# EAGLE design DTLJ_hexIO (EAGLE 7.2.0)
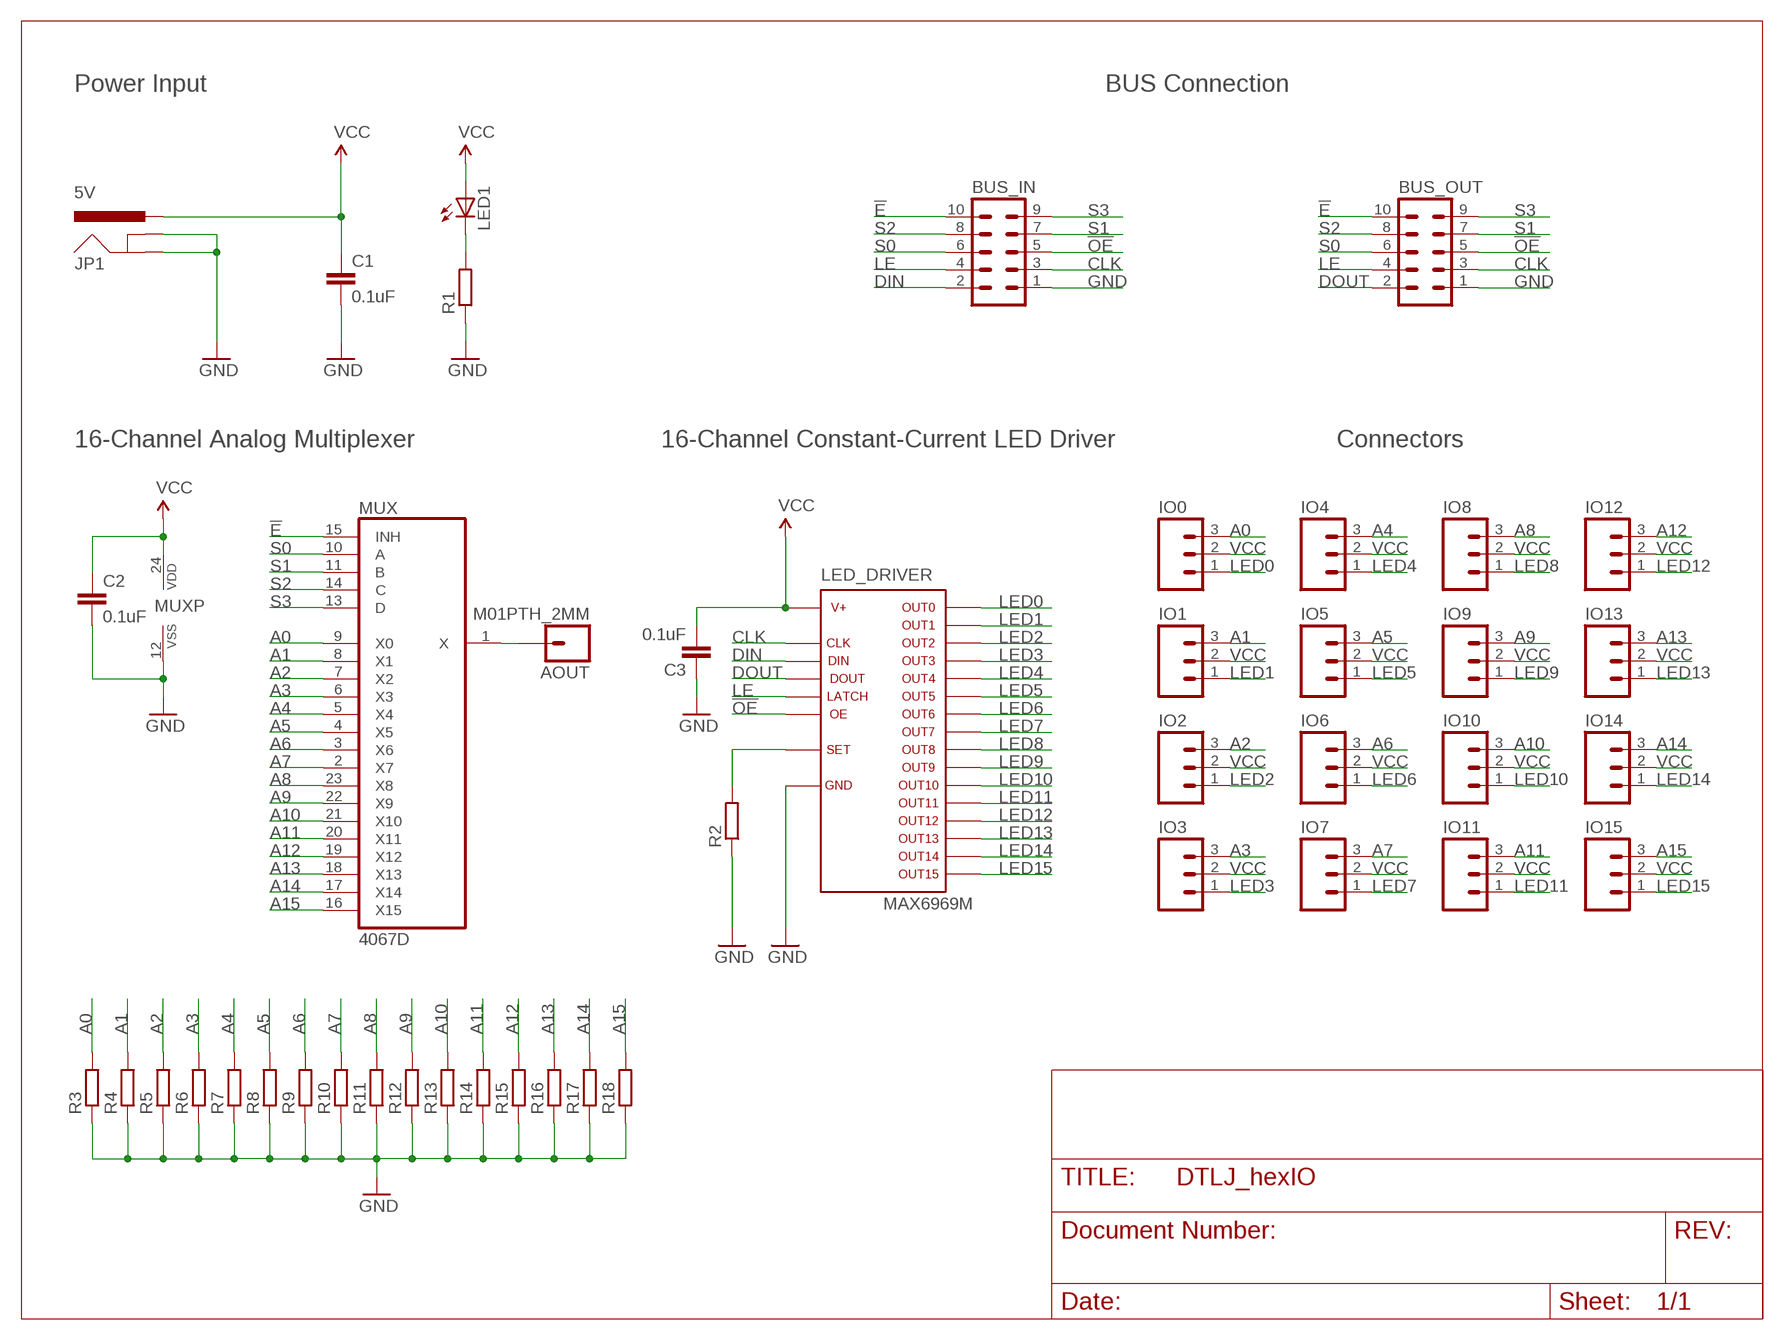
[diagram p0: schematic, sheet 1]

## Parts
AOUT  M01PTH_2MM  [1X01_2MM]
BUS_IN  ML10  [ML10]
BUS_OUT  ML10  [ML10]
C1  0.1uF  C-EU025-024X044  [C025-024X044]
C2  0.1uF  C-EU025-024X044  [C025-024X044]
C3  0.1uF  C-EU025-024X044  [C025-024X044]
IO0  M03POLAR  [MOLEX-1X3]
IO1  M03POLAR  [MOLEX-1X3]
IO2  M03POLAR  [MOLEX-1X3]
IO3  M03POLAR  [MOLEX-1X3]
IO4  M03POLAR  [MOLEX-1X3]
IO5  M03POLAR  [MOLEX-1X3]
IO6  M03POLAR  [MOLEX-1X3]
IO7  M03POLAR  [MOLEX-1X3]
IO8  M03POLAR  [MOLEX-1X3]
IO9  M03POLAR  [MOLEX-1X3]
IO10  M03POLAR  [MOLEX-1X3]
IO11  M03POLAR  [MOLEX-1X3]
IO12  M03POLAR  [MOLEX-1X3]
IO13  M03POLAR  [MOLEX-1X3]
IO14  M03POLAR  [MOLEX-1X3]
IO15  M03POLAR  [MOLEX-1X3]
JP1  5V  POWER_JACKPTH_BREAD  [POWER_JACK_PTH_BREAD]
LED1  LED3MM  [LED3MM]
LED_DRIVER  MAX6969M  [SO24W]
MUX  4067D  [SO24W]
R1  R-EU_0204/7  [0204/7]
R2  R-EU_0204/7  [0204/7]
R3  R-EU_0204/7  [0204/7]
R4  R-EU_0204/7  [0204/7]
R5  R-EU_0204/7  [0204/7]
R6  R-EU_0204/7  [0204/7]
R7  R-EU_0204/7  [0204/7]
R8  R-EU_0204/7  [0204/7]
R9  R-EU_0204/7  [0204/7]
R10  R-EU_0204/7  [0204/7]
R11  R-EU_0204/7  [0204/7]
R12  R-EU_0204/7  [0204/7]
R13  R-EU_0204/7  [0204/7]
R14  R-EU_0204/7  [0204/7]
R15  R-EU_0204/7  [0204/7]
R16  R-EU_0204/7  [0204/7]
R17  R-EU_0204/7  [0204/7]
R18  R-EU_0204/7  [0204/7]

## Nets
!E: BUS_IN.10 BUS_OUT.10 MUX.15(INH)
!OE: BUS_IN.5 BUS_OUT.5 LED_DRIVER.21
A0: IO0.3 MUX.9(X0) R3.2
A1: IO1.3 MUX.8(X1) R4.2
A2: IO2.3 MUX.7(X2) R5.2
A3: IO3.3 MUX.6(X3) R6.2
A4: IO4.3 MUX.5(X4) R7.2
A5: IO5.3 MUX.4(X5) R8.2
A6: IO6.3 MUX.3(X6) R9.2
A7: IO7.3 MUX.2(X7) R10.2
A8: IO8.3 MUX.23(X8) R11.2
A9: IO9.3 MUX.22(X9) R12.2
A10: IO10.3 MUX.21(X10) R13.2
A11: IO11.3 MUX.20(X11) R14.2
A12: IO12.3 MUX.19(X12) R15.2
A13: IO13.3 MUX.18(X13) R16.2
A14: IO14.3 MUX.17(X14) R17.2
A15: IO15.3 MUX.16(X15) R18.2
CLK: BUS_IN.3 BUS_OUT.3 LED_DRIVER.3
DIN: BUS_IN.2 LED_DRIVER.2
DOUT: BUS_OUT.2 LED_DRIVER.22
GND [power]: BUS_IN.1 BUS_OUT.1 C1.2 C2.2 C3.1 JP1.GND JP1.GNDBREAK LED_DRIVER.1 MUX.12(VSS) R1.1 R2.1 R3.1 R4.1 R5.1 R6.1 R7.1 R8.1 R9.1 R10.1 R11.1 R12.1 R13.1 R14.1 R15.1 R16.1 R17.1 R18.1
LE: BUS_IN.4 BUS_OUT.4 LED_DRIVER.4
LED0: IO0.1 LED_DRIVER.5
LED1: IO1.1 LED_DRIVER.6
LED2: IO2.1 LED_DRIVER.7
LED3: IO3.1 LED_DRIVER.8
LED4: IO4.1 LED_DRIVER.9
LED5: IO5.1 LED_DRIVER.10
LED6: IO6.1 LED_DRIVER.11
LED7: IO7.1 LED_DRIVER.12
LED8: IO8.1 LED_DRIVER.13
LED9: IO9.1 LED_DRIVER.14
LED10: IO10.1 LED_DRIVER.15
LED11: IO11.1 LED_DRIVER.16
LED12: IO12.1 LED_DRIVER.17
LED13: IO13.1 LED_DRIVER.18
LED14: IO14.1 LED_DRIVER.19
LED15: IO15.1 LED_DRIVER.20
N$1: LED1.K(C) R1.2
N$2: LED_DRIVER.23 R2.2
N$3: AOUT.1 MUX.1(X)
S0: BUS_IN.6 BUS_OUT.6 MUX.10(A)
S1: BUS_IN.7 BUS_OUT.7 MUX.11(B)
S2: BUS_IN.8 BUS_OUT.8 MUX.14(C)
S3: BUS_IN.9 BUS_OUT.9 MUX.13(D)
VCC [power]: C1.1 C2.1 C3.2 IO0.2 IO1.2 IO2.2 IO3.2 IO4.2 IO5.2 IO6.2 IO7.2 IO8.2 IO9.2 IO10.2 IO11.2 IO12.2 IO13.2 IO14.2 IO15.2 JP1.PWR LED1.A LED_DRIVER.24 MUX.24(VDD)

## Notes on the sheet
- Power Input | BUS Connection
- 16-Channel Analog Multiplexer | 16-Channel Constant-Current LED Driver | Connectors

## Library data of the parts
AOUT = SparkFun-Connectors:M01: Header 1 Standard 1-pin 0.1" header. Use with straight break away headers (SKU : PRT-00116), right angle break away headers (PRT-00553), swiss pins (PRT-00743), machine pins (PRT-00117), and female headers (PRT-00115).
BUS_IN BUS_OUT = con-ml:ML10: HARTING; OC_FARNELL: unknown; OC_NEWARK: unknown
C1-C3 = rcl:C-EU: CAPACITOR, European symbol
IO0 IO1-IO15 = SparkFun-Connectors:M03: Header 3 Standard 3-pin 0.1" header. Use with straight break away headers (SKU : PRT-00116), right angle break away headers (PRT-00553), swiss pins (PRT-00743), machine pins (PRT-00117), and female headers (PRT-00115). Molex polarized connector foot print use with SKU : PRT-08232 with associated crimp pins and housings.
JP1 = SparkFun-Connectors:POWER_JACK: Power Jack This is the standard 5.5mm barrel jack for power. The PTH is the most common, proven, reliable, footprint. The Slot footprint only works if the mill layer is transmitted to the PCB fab house so be warned. Mating wall wart : TOL-00298 (and others); PROD_ID: PRT-10811
LED1 = led:LED: LED OSRAM: - CHIPLED LG R971, LG N971, LY N971, LG Q971, LY Q971, LO R971, LY R971 LH N974, LH R974 LS Q976, LO Q976, LY Q976 LO Q996 - Hyper CHIPLED LW Q18S LB Q993, LB Q99A, LB R99A - SideLED LS A670, LO A670, LY A670, LG A670, LP A670 LB A673, LV A673, LT A673, LW A673 LH A674 LY A675 LS A676, LA A676, LO A676, LY A676, LW A676 LS A679, LY A679, LG A679 - Hyper Micro SIDELED® LS Y876, LA Y876, LO Y876, LY Y876 LT Y87S - SmartLED LW L88C, LW L88S LB L89C, LB L89S, LG L890 LS L89K, LO L89K, LY L89K LS L896, LA L896, LO L896, LY L896 - TOPLED LS T670, LO T670, LY T670, LG T670, LP T670 LSG T670, LSP T670, LSY T670, LOP T670, LYG T670 LG T671, LOG T671, LSG T671 LB T673, LV T673, LT T673, LW T673 LH T674 LS T676, LA T676, LO T676, LY T676, LB T676, LH T676, LSB T676, LW T676 LB T67C, LV T67C, LT T67C, LS T67K, LO T67K, LY T67K, LW E67C LS E67B, LA E67B, LO E67B, LY E67B, LB E67C, LV E67C, LT E67C LW T67C LS T679, LY T679, LG T679 LS T770, LO T770, LY T770, LG T770, LP T770 LB T773, LV T773, LT T773, LW T773 LH T774 LS E675, LA E675, LY E675, LS T675 LS T776, LA T776, LO T776, LY T776, LB T776 LHGB T686 LT T68C, LB T68C - Hyper Mini TOPLED® LB M676 - Mini TOPLED Santana® LG M470 LS M47K, LO M47K, LY M47K Source: http://www.osram.convergy.de LUXEON: - LUMILED® LXK2-PW12-R00, LXK2-PW12-S00, LXK2-PW14-U00, LXK2-PW14-V00 LXK2-PM12-R00, LXK2-PM12-S00, LXK2-PM14-U00 LXK2-PE12-Q00, LXK2-PE12-R00, LXK2-PE12-S00, LXK2-PE14-T00, LXK2-PE14-U00 LXK2-PB12-K00, LXK2-PB12-L00, LXK2-PB12-M00, LXK2-PB14-N00, LXK2-PB14-P00, LXK2-PB14-Q00 LXK2-PR12-L00, LXK2-PR12-M00, LXK2-PR14-Q00, LXK2-PR14-R00 LXK2-PD12-Q00, LXK2-PD12-R00, LXK2-PD12-S00 LXK2-PH12-R00, LXK2-PH12-S00 LXK2-PL12-P00, LXK2-PL12-Q00, LXK2-PL12-R00 Source: www.luxeon.com KINGBRIGHT: KA-3528ASYC Source: www.kingbright.com
LED_DRIVER = max6969:MAX6969
MUX = 40xx:4067: 16-channel ANALOG MULTIPLEXER
R1-R18 = rcl:R-EU_: RESISTOR, European symbol

## Net classes
0 default: width 0.508 mm, drill 0.33 mm, clearance 0.254 mm
1 power: width 0.889 mm, drill 0.33 mm, clearance 0.381 mm

## Board
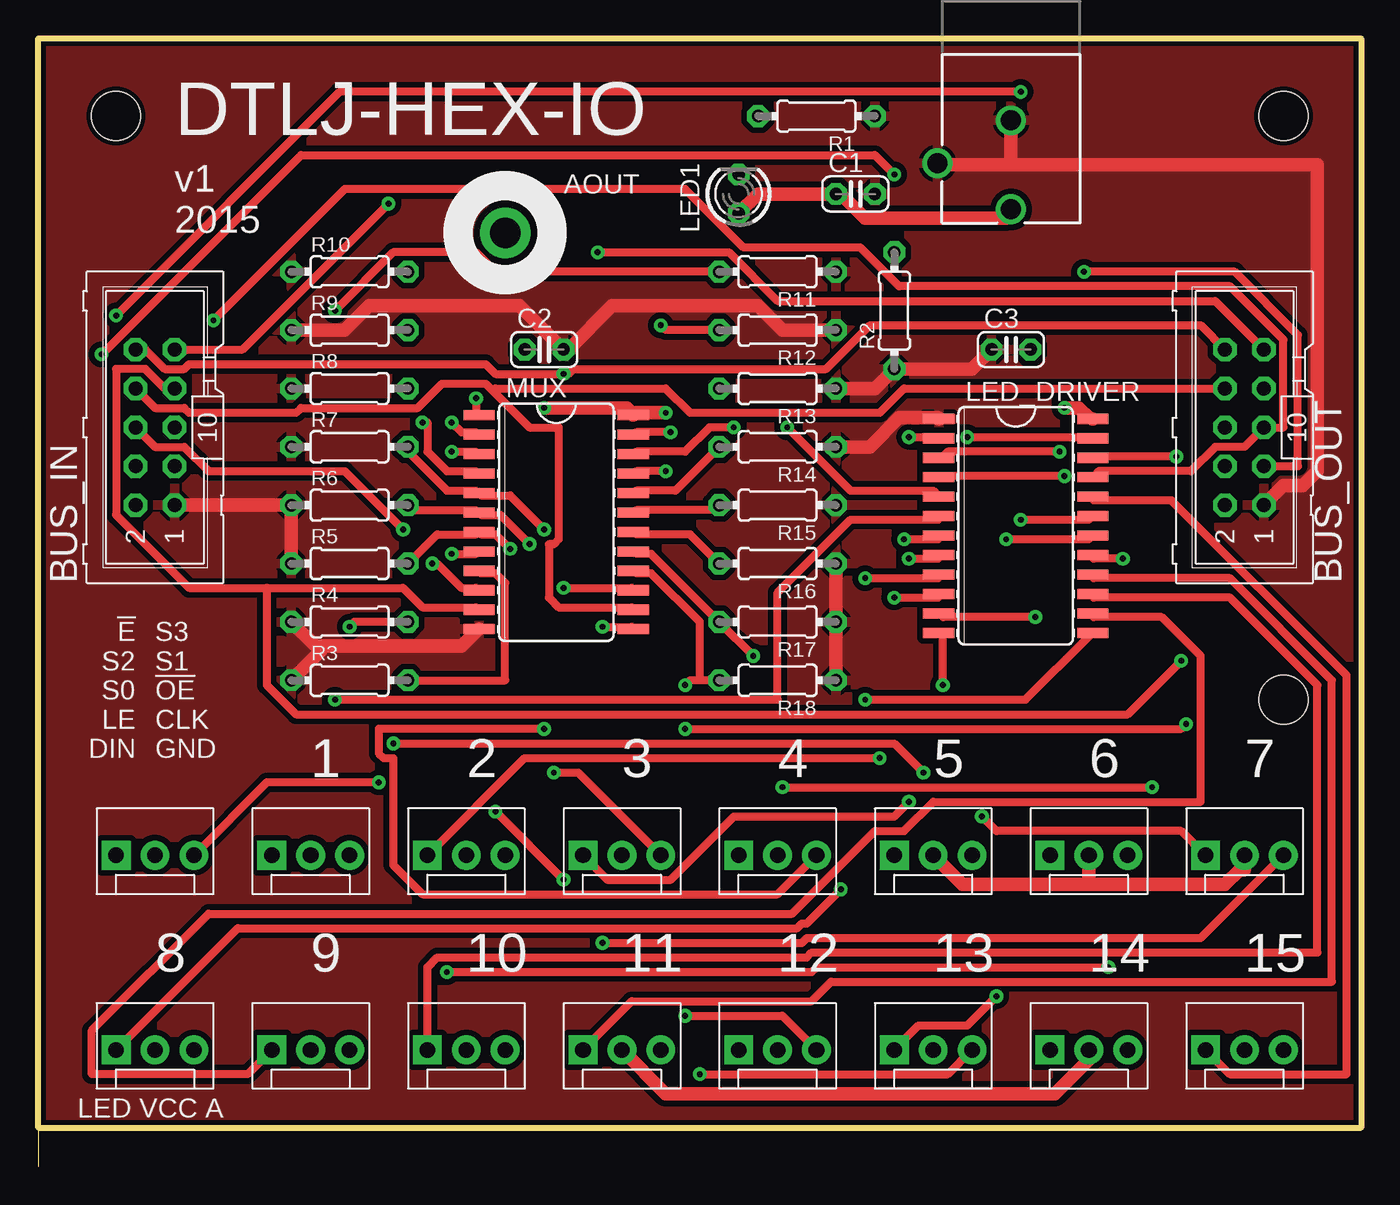
[diagram p1: board, top side]
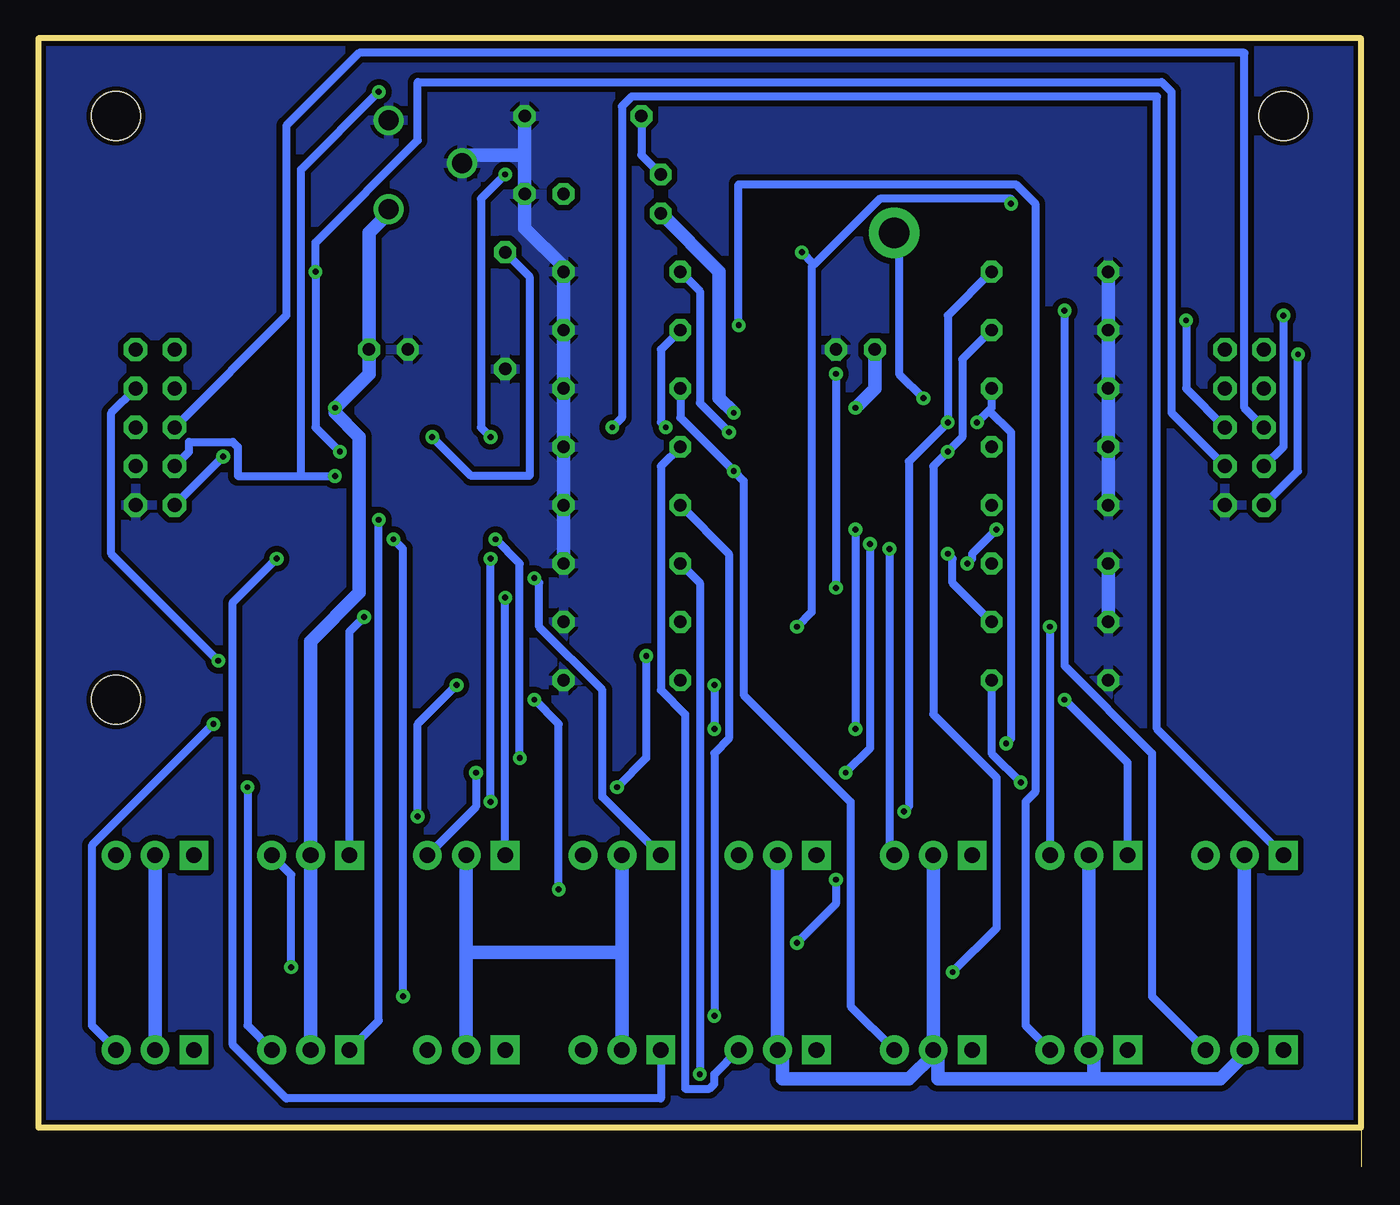
[diagram p2: board, bottom side, seen from below]

Size 86.36 x 73.66 mm. Coordinates in mm from the lower left corner, seen from the top.
Outline: 0,2.54 0,0
Outline: 0,2.54 0,73.66 86.36,73.66 86.36,2.54 0,2.54
Copper layers (1*16): Top 0.035mm / dielectric 1.5mm / Bottom 0.035mm
Design rules "20trace-10clearance": minimum track width 20mil, minimum drill 15mil, track to track 10mil, track to pad 10mil, pad to pad 10mil, via to via 10mil, smd to smd 10mil, copper to edge 10mil, drill to drill 10mil, minimum pad ring 12mil, minimum via ring 10mil, stop-mask expansion 4mil, vias tented up to drill 20mil, thermal gap 10mil
Holes 3.2 mm at 81.28,68.58 81.28,30.48 5.08,68.58

### Footprints (pad centres in the part's own frame; a part is rotated, then mirrored left to right if it is on the bottom)
1X01_2MM = drill 2 pad 3.302: 1 0,0
ML10 = drill 0.914 octagon: 1 -5.08,-1.27; 2 -5.08,1.27; 3 -2.54,-1.27; 4 -2.54,1.27; 5 0,-1.27; 6 0,1.27; 7 2.54,-1.27; 8 2.54,1.27; 9 5.08,-1.27; 10 5.08,1.27
C025-024X044 = drill 0.813 octagon: 1 -1.27,0; 2 1.27,0
MOLEX-1X3 = drill 1.016 pad 1.88 square: 1 0,0 | drill 1.016 pad 1.88: 2 2.54,0; 3 5.08,0
POWER_JACK_PTH_BREAD = drill 1.3: GND 0,7.9; GNDBREAK 4.8,10.7; PWR 0,13.7
LED3MM = drill 0.813 octagon: A -1.27,0; K 1.27,0
SO24W = smd 0.66 x 2.032: 1 -6.985,-5.029; 2 -5.715,-5.029; 3 -4.445,-5.029; 4 -3.175,-5.029; 5 -1.905,-5.029; 6 -0.635,-5.029; 7 0.635,-5.029; 8 1.905,-5.029; 9 3.175,-5.029; 10 4.445,-5.029; 11 5.715,-5.029; 12 6.985,-5.029; 13 6.985,5.029; 14 5.715,5.029; 15 4.445,5.029; 16 3.175,5.029; 17 1.905,5.029; 18 0.635,5.029; 19 -0.635,5.029; 20 -1.905,5.029; 21 -3.175,5.029; 22 -4.445,5.029; 23 -5.715,5.029; 24 -6.985,5.029
0204/7 = drill 0.813 octagon: 1 -3.81,0; 2 3.81,0

### Placement (x,y rotation side)
AOUT  30.48,60.96 0 top
BUS_IN  7.62,48.26 90 top
BUS_OUT  78.74,48.26 90 top
C1  53.34,63.5 0 top
C2  33.02,53.34 0 top
C3  63.5,53.34 0 top
IO0  5.08,20.32 0 top
IO1  15.24,20.32 0 top
IO2  25.4,20.32 0 top
IO3  35.56,20.32 0 top
IO4  45.72,20.32 0 top
IO5  55.88,20.32 0 top
IO6  66.04,20.32 0 top
IO7  76.2,20.32 0 top
IO8  5.08,7.62 0 top
IO9  15.24,7.62 0 top
IO10  25.4,7.62 0 top
IO11  35.56,7.62 0 top
IO12  45.72,7.62 0 top
IO13  55.88,7.62 0 top
IO14  66.04,7.62 0 top
IO15  76.2,7.62 0 top
JP1  63.5,76.2 180 top
LED1  45.72,63.5 90 top
LED_DRIVER  63.81,41.83 270 top
MUX  33.81,42.07 270 top
R1  50.8,68.58 180 top
R2  55.88,55.88 90 top
R3  20.32,31.75 0 top
R4  20.32,35.56 0 top
R5  20.32,39.37 0 top
R6  20.32,43.18 0 top
R7  20.32,46.99 0 top
R8  20.32,50.8 0 top
R9  20.32,54.61 0 top
R10  20.32,58.42 0 top
R11  48.26,58.42 180 top
R12  48.26,54.61 180 top
R13  48.26,50.8 180 top
R14  48.26,46.99 180 top
R15  48.26,43.18 180 top
R16  48.26,39.37 180 top
R17  48.26,35.56 180 top
R18  48.26,31.75 180 top

### Tracks (layer width: path | path; a pad name or v marks a point on that pad's centre or on a via)
!E  (via drill 0.38)
  Top 0.508: v34.29,37.78 38.73,37.78 MUX.15 | BUS_IN.10 6.99,53.34 8.26,52.07 9.53,52.07 9.84,52.39 29.21,52.39 29.84,51.75 v34.29,51.75 34.61,51.75 34.92,52.07 51.44,52.07 54.29,54.93 75.88,54.93 BUS_OUT.10
  Bottom 0.508: v34.29,51.75 v34.29,37.78
!OE  (via drill 0.38)
  Top 0.508: LED_DRIVER.21 68.9,45.09 69.22,45.4 75.25,45.4 76.83,46.99 78.74,46.99 BUS_OUT.5 81.28,48.26 81.28,53.98 77.79,57.47 56.2,57.47 53.66,60.01 46.04,60.01 42.23,63.82 20,63.82 v11.43,55.24
  Bottom 0.508: BUS_IN.5 11.43,50.8 v11.43,55.24
A0  (via drill 0.38)
  Top 0.508: R3.2 30.48,31.75 30.48,38.1 29.84,38.73 28.89,38.73 MUX.9 | IO0.3 14.92,25.08 v22.23,25.08
  Bottom 0.508: v22.23,25.08 24.13,26.99 R3.2
A1  (via drill 0.38)
  Top 0.508: v26.99,40.01 28.57,40.01 MUX.8 | v20.32,35.24 20.64,35.56 R4.2
  Bottom 0.508: v26.99,40.01 26.67,39.69 26.67,38.1 R4.2 | v20.32,35.24 IO1.3
A2  (via drill 0.38)
  Top 0.508: R5.2 26.04,41.27 28.57,41.27 MUX.7 28.89,41.27 29.84,41.27 v30.8,40.32
  Bottom 0.508: IO2.3 30.8,20.64 v30.8,40.32
A3  (via drill 0.38)
  Top 0.508: R6.2 24.45,42.86 28.57,42.86 MUX.6 28.89,42.55 30.16,42.55 v32.07,40.64 | IO3.3 35.24,25.72 v33.66,25.72
  Bottom 0.508: v33.66,25.72 32.07,27.3 v32.07,40.64
A4  (via drill 0.38)
  Top 0.508: R7.2 24.13,46.67 26.67,44.13 28.57,44.13 MUX.5 28.89,43.81 30.8,43.81 v33.02,41.59 | IO4.3 48.26,17.78 25.08,17.78 23.18,19.68 23.18,26.67 22.54,26.67 22.23,26.99 22.23,28.57 v33.02,28.57
  Bottom 0.508: v33.02,41.59 v33.02,28.57
A5  (via drill 0.38)
  Top 0.508: v25.08,48.58 25.4,48.58 25.4,46.67 26.67,45.4 28.57,45.4 MUX.4 | v57.78,25.72 55.88,27.62 v23.18,27.62
  Bottom 0.508: 24.29,49.37 24.13,49.53 R8.2 | 24.29,49.37 v25.08,48.58 | IO5.3 57.78,23.5 v57.78,25.72 | v23.18,27.62 22.86,27.94 22.86,47.94 24.29,49.37
A6  (via drill 0.38)
  Top 0.508: v26.99,46.67 28.57,46.67 MUX.3 | v69.85,13.02 50.8,13.02 50.48,12.7 v26.67,12.7
  Bottom 0.508: R9.2 26.04,52.7 26.04,47.62 v26.99,46.67 27.94,45.72 27.94,29.53 23.81,25.4 23.81,15.56 v26.67,12.7 | IO6.3 69.85,19.05 v69.85,13.02
A7  (via drill 0.38)
  Top 0.508: v26.99,48.58 27.62,47.94 28.57,47.94 MUX.2 | IO7.3 75.88,14.92 50.16,14.92 49.85,14.61 v36.83,14.61 | v29.84,23.18 v34.29,18.73
  Bottom 0.508: R10.2 26.99,55.56 v26.99,48.58 29.53,46.04 29.53,23.5 v29.84,23.18 | v36.83,14.61 34.29,17.14 v34.29,18.73
A8  (via drill 0.38)
  Top 0.508: v41.27,47.94 39.05,47.94 MUX.23 | v19.37,55.88 23.18,59.69 28.57,59.69 29.84,58.42 R11.2
  Bottom 0.508: v41.27,47.94 43.18,49.85 43.18,57.15 R11.2 | IO8.3 13.65,11.11 13.65,26.99 19.37,32.7 v19.37,55.88
A9  (via drill 0.38)
  Top 0.508: v45.4,48.26 43.81,48.26 42.23,46.67 39.05,46.67 MUX.22 | v40.64,54.93 40.96,54.61 R12.2
  Bottom 0.508: v45.4,48.26 45.72,48.58 45.72,53.34 R12.2 | IO9.3 21.91,9.21 21.91,23.81 21.27,24.45 21.27,62.87 22.54,64.14 40.64,64.14 v40.64,54.93
A10  (via drill 0.38)
  Top 0.508: v40.96,45.4 39.05,45.4 MUX.21
  Bottom 0.508: R13.2 44.45,48.9 v40.96,45.4 40.32,44.77 40.32,30.8 33.34,23.81 33.34,10.48 IO10.3
A11
  Top 0.508: R14.2 41.59,44.13 39.05,44.13 MUX.20
  Bottom 0.508: IO11.3 42.23,6.03 42.23,5.4 42.55,5.08 44.13,5.08 44.13,29.53 45.72,31.11 45.72,45.72 R14.2
A12  (via drill 0.38)
  Top 0.508: R15.2 44.13,42.86 39.05,42.86 MUX.19 | IO12.3 48.58,9.84 v42.23,9.84
  Bottom 0.508: v42.23,9.84 42.23,26.99 41.27,27.94 41.27,40.01 R15.2
A13  (via drill 0.38)
  Top 0.508: R16.2 42.55,41.27 39.05,41.27 MUX.18 | IO13.3 59.37,6.03 v43.18,6.03
  Bottom 0.508: v43.18,6.03 43.18,38.1 R16.2
A14  (via drill 0.38)
  Top 0.508: MUX.17 39.05,40.01 40.01,40.01 R17.2 v46.67,33.34 | v48.58,24.77 v72.71,24.77
  Bottom 0.508: IO14.3 72.71,9.21 v72.71,24.77 | v48.58,24.77 46.67,26.67 v46.67,33.34
A15  (via drill 0.38)
  Top 0.508: 43.18,31.75 43.18,35.56 40.01,38.73 39.05,38.73 MUX.16 | R18.2 43.18,31.75 | v74.93,28.89 74.61,28.57 v42.23,28.57 | v42.23,31.43 42.55,31.75 43.18,31.75
  Bottom 0.508: IO15.3 82.87,9.21 82.87,20.95 v74.93,28.89 | v42.23,31.43 v42.23,28.57
CLK  (via drill 0.38)
  Top 0.508: v66.67,46.67 59.37,46.67 59.05,46.35 LED_DRIVER.3 | v68.26,58.42 78.11,58.42 82.23,54.29 82.23,45.72 BUS_OUT.3
  Bottom 0.508: v66.67,46.67 68.26,48.26 v68.26,58.42 68.26,60.33 61.59,66.99 61.59,70.8 13.02,70.8 12.38,70.17 12.38,49.21 BUS_IN.3
DIN  (via drill 0.38)
  Top 0.508: v56.83,47.62 58.74,47.62 LED_DRIVER.2 | v55.88,64.77 54.61,66.04 17.14,66.04 v4.13,53.02
  Bottom 0.508: v56.83,47.62 57.47,48.26 57.47,63.18 v55.88,64.77 | v4.13,53.02 4.13,45.4 BUS_IN.2
DOUT  (via drill 0.38)
  Top 0.508: v74.3,46.35 68.9,46.35 LED_DRIVER.22
  Bottom 0.508: BUS_OUT.2 v74.3,46.35
GND
  Top 0.889: 18.41,33.97 18.1,33.97 R4.1 | 18.41,33.97 27.62,33.97 28.57,34.92 MUX.12 | R3.1 18.41,33.66 18.41,33.97 | R5.1 R6.1 BUS_IN.1 | R9.1 20,54.61 21.59,56.2 31.43,56.2 C2.2 34.61,53.34 37.47,56.2 46.99,56.2 48.58,54.61 R12.1 | R18.1 R17.1 R16.1 | R14.1 54.29,46.99 56.2,48.9 58.74,48.9 LED_DRIVER.1 | R13.1 54.61,50.8 R2.1 60.96,52.07 C3.1 | BUS_OUT.1 81.28,44.45 82.55,44.45 83.5,45.4 83.5,65.41 63.5,65.41 | 63.5,65.41 58.74,65.41 JP1.GNDBREAK | 63.5,65.41 JP1.GND
  Bottom 0.889: R10.1 R9.1 R8.1 R7.1 R6.1 | R5.1 R4.1 | R16.1 R15.1 R14.1 R13.1 R12.1 R11.1 52.07,58.74 54.61,61.28 C1.2 54.61,66.04 | R1.1 54.61,66.04 | 54.61,66.04 58.42,66.04 58.42,65.72 JP1.GNDBREAK
  pour Bottom (isolate 0.305): 0,73.66 86.36,73.66 86.36,2.54 0,2.54
  pour Top (isolate 0.305): 0,73.66 86.36,73.66 86.36,2.54 0,2.54
LE  (via drill 0.38)
  Top 0.508: v66.99,45.09 59.05,45.09 LED_DRIVER.4 | v5.08,55.56 19.68,70.17 v64.14,70.17
  Bottom 0.508: 69.22,45.09 73.34,45.09 73.34,46.99 73.66,47.31 76.52,47.31 76.52,46.67 BUS_OUT.4 | 69.22,45.09 v66.99,45.09 | BUS_IN.4 5.08,46.99 v5.08,55.56 | v64.14,70.17 69.22,65.09 69.22,45.09
LED0  (via drill 0.38)
  Top 0.508: v48.9,48.26 53.02,44.13 58.42,44.13 58.74,43.81 LED_DRIVER.5
  Bottom 0.508: v48.9,48.26 48.26,48.9 48.26,69.22 47.62,69.85 13.34,69.85 13.34,28.57 IO0.1
LED1  (via drill 0.38)
  Top 0.508: v19.37,30.48 48.26,30.48 48.26,37.47 53.02,42.23 58.74,42.23 LED_DRIVER.6
  Bottom 0.508: v19.37,30.48 15.24,26.35 IO1.1
LED2  (via drill 0.38)
  Top 0.508: v56.52,40.96 58.74,40.96 LED_DRIVER.7 | v54.93,26.67 31.75,26.67 IO2.1
  Bottom 0.508: v56.52,40.96 54.93,39.37 v54.93,26.67
LED3  (via drill 0.38)
  Top 0.508: v56.83,39.69 58.74,39.69 LED_DRIVER.8 | v56.83,23.81 55.88,22.86 45.4,22.86 41.27,18.73 37.15,18.73 IO3.1
  Bottom 0.508: v56.83,23.81 v56.83,39.69
LED4  (via drill 0.38)
  Top 0.508: v53.98,38.42 58.74,38.42 LED_DRIVER.9
  Bottom 0.508: v53.98,38.42 53.66,38.1 53.66,35.24 49.53,31.11 49.53,24.13 IO4.1
LED5  (via drill 0.38)
  Top 0.508: v55.88,37.15 58.74,37.15 LED_DRIVER.10
  Bottom 0.508: IO5.1 v55.88,37.15
LED6  (via drill 0.38)
  Top 0.508: v65.09,35.88 59.05,35.88 LED_DRIVER.11
  Bottom 0.508: v65.09,35.88 66.04,34.92 IO6.1
LED7  (via drill 0.38)
  Top 0.508: v59.05,31.43 59.05,34.61 LED_DRIVER.12 | v61.59,22.86 62.55,21.91 74.61,21.91 IO7.1
  Bottom 0.508: v59.05,31.43 61.59,28.89 v61.59,22.86
LED8  (via drill 0.38)
  Top 0.508: v53.98,30.48 64.45,30.48 68.58,34.61 LED_DRIVER.13 | v52.39,18.1 50.16,15.88 49.85,15.88 49.53,15.56 13.02,15.56 IO8.1
  Bottom 0.508: v53.98,30.48 52.39,28.89 v52.39,18.1
LED9
  Top 0.508: IO9.1 13.65,6.03 3.49,6.03 3.49,8.89 11.11,16.51 49.21,16.51 54.61,21.91 56.52,21.91 58.42,23.81 75.88,23.81 75.88,33.34 73.34,35.88 68.9,35.88 LED_DRIVER.14
LED10
  Top 0.508: IO10.1 25.4,13.02 26.04,13.65 50.16,13.65 50.48,13.97 83.5,13.97 83.5,31.43 77.79,37.15 68.9,37.15 LED_DRIVER.15
LED11
  Top 0.508: IO11.1 38.73,10.79 50.48,10.79 51.75,12.06 84.45,12.06 84.45,31.75 77.79,38.42 68.9,38.42 LED_DRIVER.16
LED12  (via drill 0.38)
  Top 0.508: v70.8,39.69 68.9,39.69 LED_DRIVER.17
  Bottom 0.508: v70.8,39.69 73.66,36.83 73.66,7.94 70.17,4.45 45.72,4.45 IO12.1
LED13  (via drill 0.38)
  Top 0.508: v63.18,40.96 68.58,40.96 LED_DRIVER.18 | v62.55,11.11 60.64,9.21 57.47,9.21 IO13.1
  Bottom 0.508: v63.18,40.96 62.55,40.32 v62.55,11.11
LED14  (via drill 0.38)
  Top 0.508: v64.14,42.23 68.58,42.23 LED_DRIVER.19
  Bottom 0.508: v64.14,42.23 64.14,9.53 IO14.1
LED15
  Top 0.508: IO15.1 77.79,6.03 85.41,6.03 85.41,32.07 73.98,43.5 68.9,43.5 LED_DRIVER.20
N$1
  Bottom 0.508: LED1.K 46.99,66.04 R1.2
N$2  (via drill 0.38)
  Top 0.508: v60.64,47.62 68.58,47.62 LED_DRIVER.23
  Bottom 0.508: v60.64,47.62 58.1,45.09 54.29,45.09 54.29,58.1 R2.2
N$3  (via drill 0.38)
  Top 0.508: v28.57,50.16 28.57,49.21 MUX.1
  Bottom 0.508: v28.57,50.16 30.16,51.75 30.16,60.64 AOUT.1
S0  (via drill 0.38)
  Top 0.508: v25.72,39.37 26.04,39.37 27.62,37.78 28.57,37.78 MUX.10 | v23.81,41.59 20,45.4 11.11,45.4 9.53,46.99 7.62,46.99 BUS_IN.6
  Bottom 0.508: v25.72,39.37 25.4,39.69 25.4,40.01 v23.81,41.59 | BUS_OUT.6 70.17,55.56 70.17,67.94 65.41,72.71 7.62,72.71 7.62,49.53 BUS_IN.6
S1  (via drill 0.38)
  Top 0.508: 14.92,37.78 9.84,37.78 5.08,42.55 5.08,52.07 6.99,52.07 8.26,50.8 BUS_IN.7 | 14.92,37.78 23.81,37.78 25.08,36.51 28.57,36.51 MUX.11 | v74.61,33.02 71.12,29.53 16.83,29.53 14.92,31.43 14.92,37.78
  Bottom 0.508: BUS_OUT.7 81.6,49.21 81.6,40.01 v74.61,33.02
S2
  Top 0.508: 29.69,50.64 29.21,51.12 26.35,51.12 24.77,49.53 17.14,49.53 16.83,49.21 9.84,49.21 9.53,49.53 7.62,49.53 BUS_IN.8 | 29.69,50.64 32.07,48.26 33.97,48.26 33.97,40.96 33.66,40.64 33.34,40.64 33.34,37.15 33.97,36.51 38.73,36.51 MUX.14 | BUS_OUT.8 56.52,50.8 54.93,49.21 42.55,49.21 40.96,50.8 29.84,50.8 29.69,50.64
S3  (via drill 0.38)
  Top 0.508: v36.83,35.24 38.73,35.24 MUX.13 | v22.86,62.87 13.34,53.34 BUS_IN.9 | BUS_OUT.9 76.83,56.52 48.26,56.52 45.09,59.69 v36.51,59.69
  Bottom 0.508: v36.83,35.24 35.88,36.2 35.88,58.74 35.72,58.9 | 35.72,58.9 31.43,63.18 22.86,63.18 v22.86,62.87 | 35.72,58.9 v36.51,59.69
VCC  (via drill 0.38)
  Top 0.889: v33.02,49.53 38.42,49.53 38.73,49.21 MUX.24 39.05,49.21 v40.96,49.21 | LED1.A 46.99,63.5 C1.1 52.39,63.5 53.98,61.91 63.18,61.91 63.5,62.23 JP1.PWR | v66.99,49.53 67.94,49.53 68.58,48.9 LED_DRIVER.24 | 68.58,18.41 IO6.2 | 68.58,18.41 60.33,18.41 IO5.2 | IO7.2 78.74,19.37 78.42,19.37 77.47,18.41 68.58,18.41 | IO11.2 40.96,4.76 66.36,4.76 68.58,6.99 IO14.2
  Bottom 0.889: v33.02,49.53 31.75,50.8 C2.1 | JP1.PWR 63.5,62.23 64.77,60.96 C3.2 64.77,51.75 v66.99,49.53 66.99,49.21 65.41,47.62 65.41,37.47 68.58,34.29 IO6.2 IO14.2 | v40.96,49.21 41.91,50.16 41.91,58.42 LED1.A | IO0.2 IO8.2 7.62,7.3 9.21,5.71 17.46,5.71 | IO1.2 IO9.2 17.46,7.62 17.46,5.71 | IO2.2 IO10.2 | IO3.2 IO11.2 37.78,7.62 37.78,5.71 29.53,5.71 27.94,7.3 IO10.2 | 17.46,5.71 27.62,5.71 27.62,7.3 IO10.2 | IO7.2 IO15.2 | IO4.2 48.26,13.97 | 48.26,13.97 IO12.2 | IO5.2 58.42,13.97 | 58.42,13.97 IO13.2 | 58.42,13.97 48.26,13.97

### Text on the board
tNames: DTLJ-HEX-IO | v1 / 2015 | !E / S2 / S0 / LE / DIN | S3 / S1 / !OE / CLK / GND | 1 | 2 | 3 | 4 | 5 | 6 | 7 | 8 | 9 | 10 | 11 | 12 | 13 | 14 | 15 | LED VCC A